# EasyEDA schematic SCH_rover_2025-12-09.json

## Sheets
1 Sheet_1: TITLE: Sheet_1; REV: 1.0; Date: 2025-12-09; Sheet: 1/1; Company: Your Company
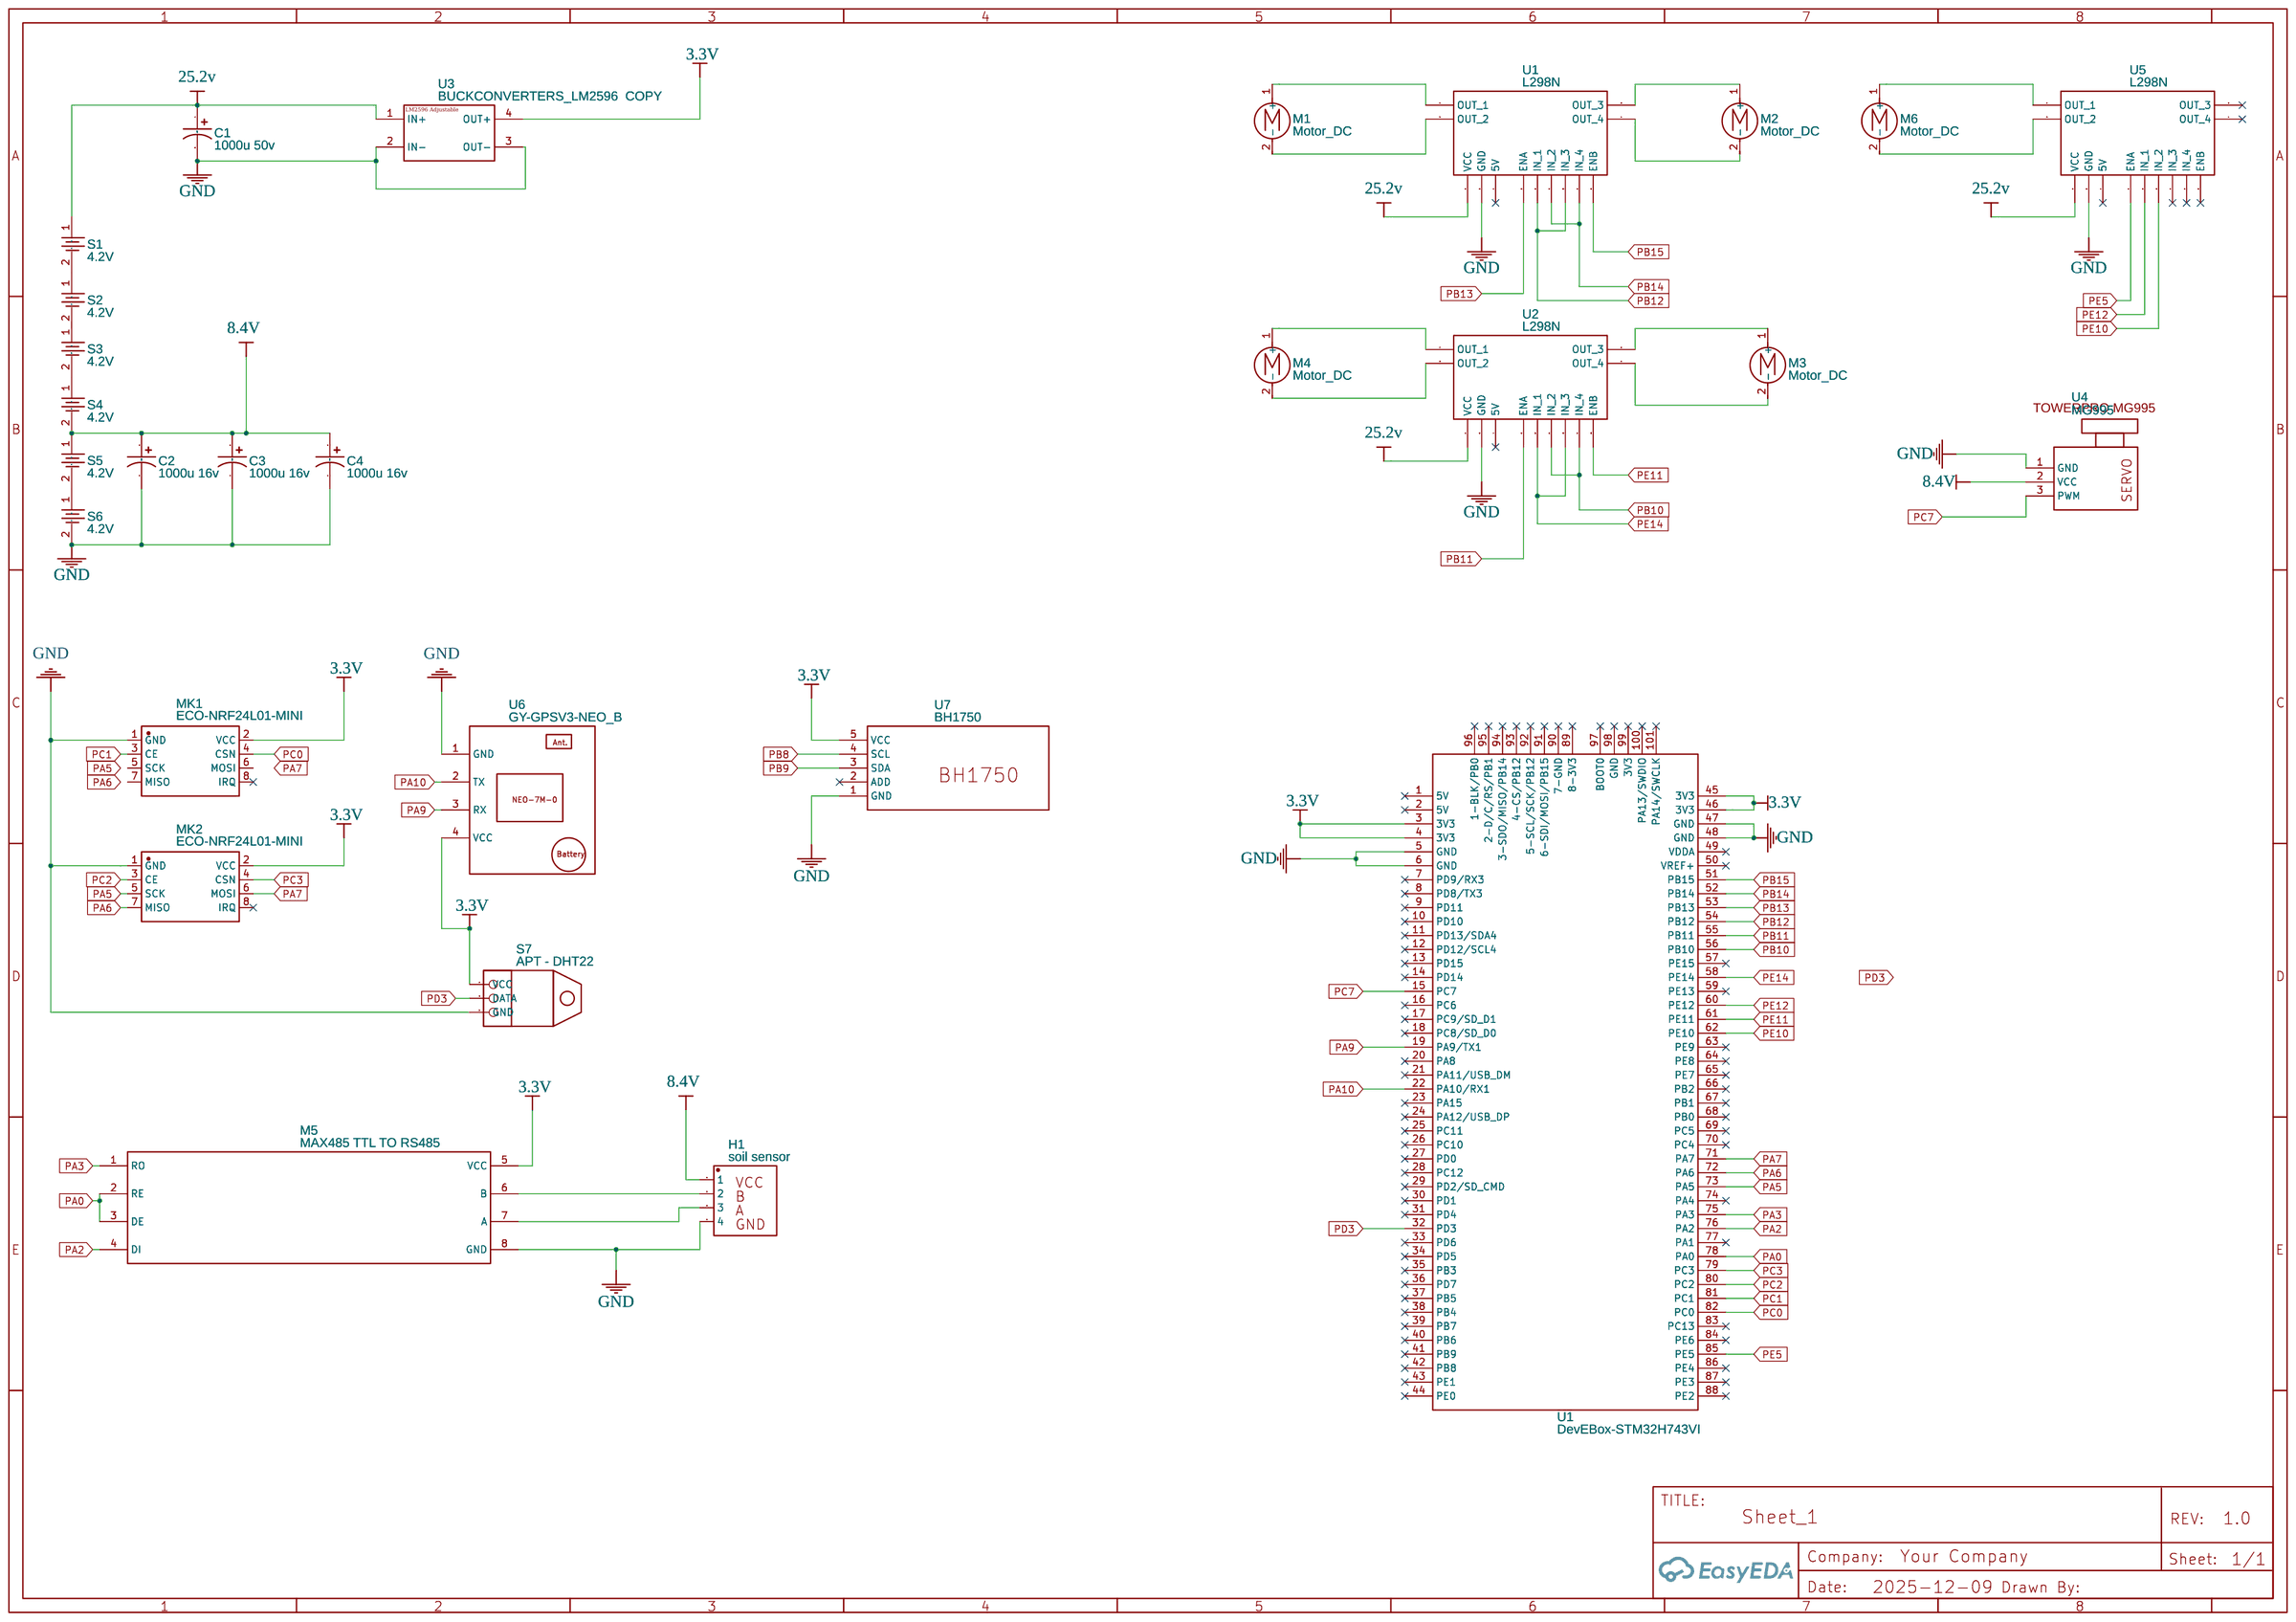
[diagram p0: Sheet_1]
2 Sheet_2: TITLE: Sheet_2
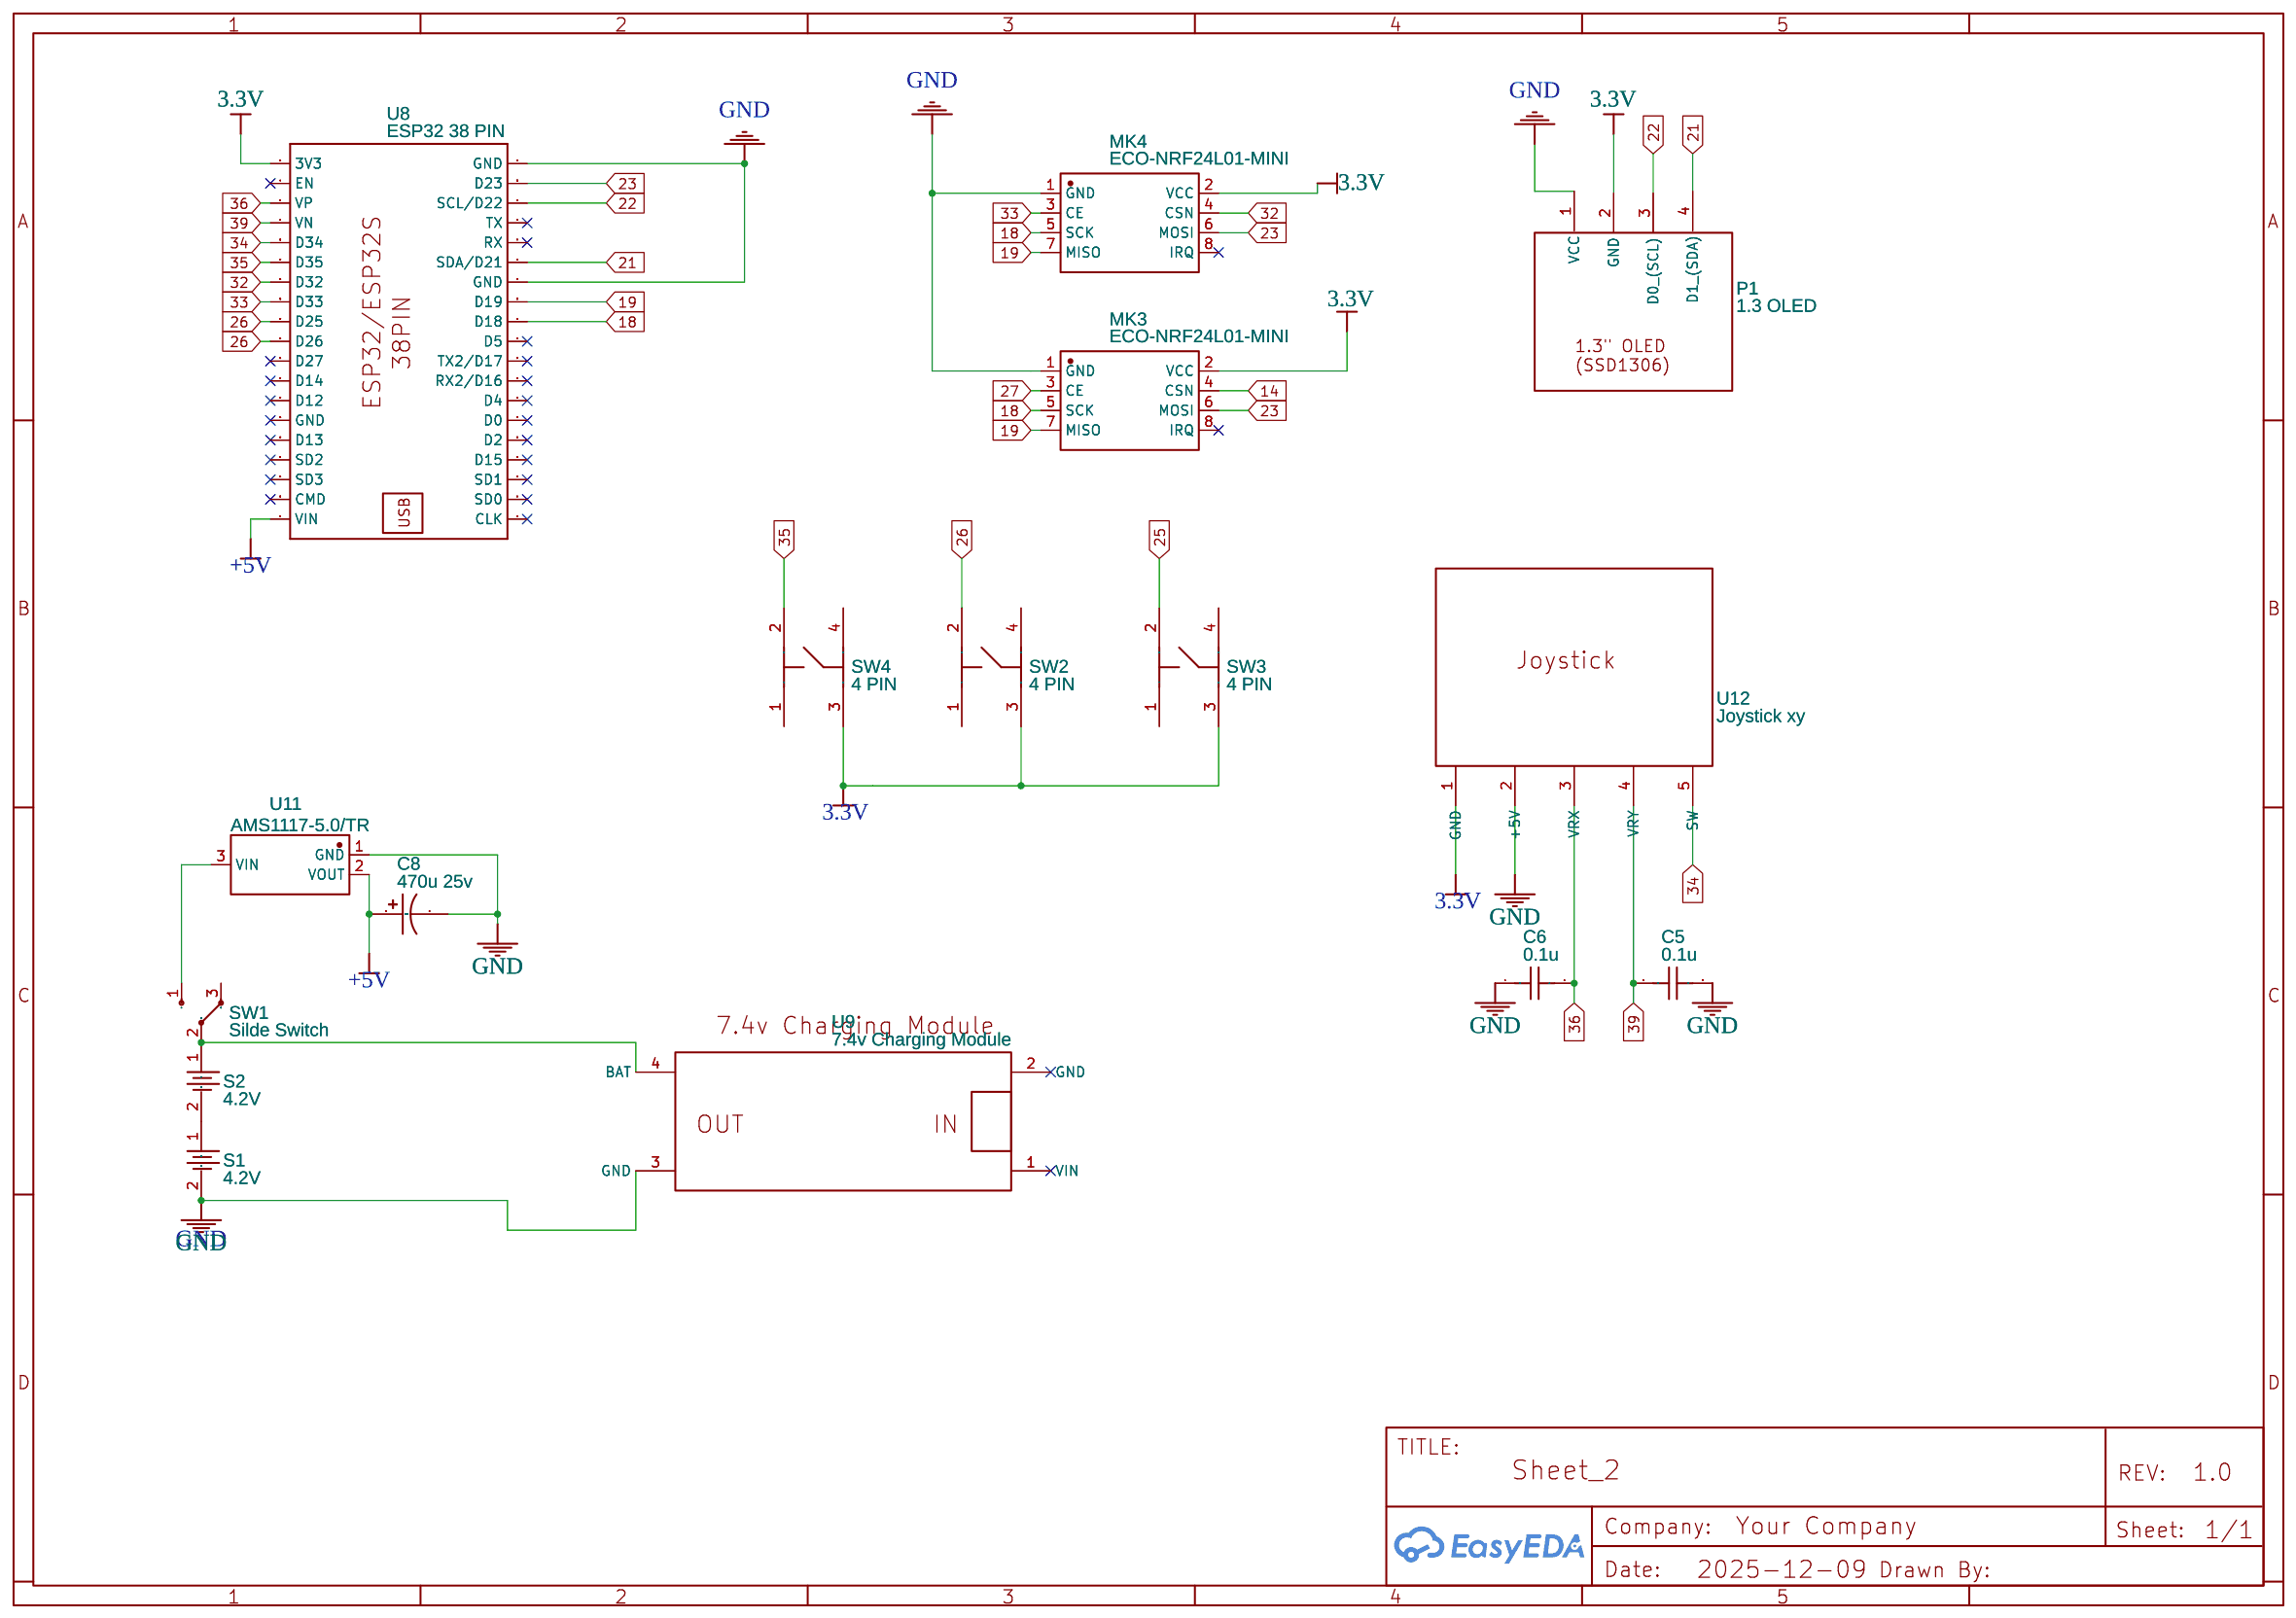
[diagram p1: Sheet_2]

## Parts
sheet Sheet_1
C1  1000u 50v  [CASE-A_3216]
C2  1000u 16v  [CASE-A_3216]
C3  1000u 16v  [CASE-A_3216]
C4  1000u 16v  [CASE-A_3216]
H1  soil sensor  [HEAD-RS485]
M1  Motor_DC  [CONN-TH_2P-P5.08]
M2  Motor_DC  [CONN-TH_2P-P5.08]
M3  Motor_DC  [CONN-TH_2P-P5.08]
M4  Motor_DC  [CONN-TH_2P-P5.08]
M5  MAX485 TTL TO RS485  [MAX485-TTLXRS485]
M6  Motor_DC  [CONN-TH_2P-P5.08]
MK1  ECO-NRF24L01-MINI  [ECO-NRF24L01-MINI]
MK2  ECO-NRF24L01-MINI  [ECO-NRF24L01-MINI]
S1  4.2V  [BAT-SMD_CR1220-2]
S2  4.2V  [BAT-SMD_CR1220-2]
S3  4.2V  [BAT-SMD_CR1220-2]
S4  4.2V  [BAT-SMD_CR1220-2]
S5  4.2V  [BAT-SMD_CR1220-2]
S6  4.2V  [BAT-SMD_CR1220-2]
S7  APT - DHT22  [DHT22]
U1  DevEBox-STM32H743VI  [DEVEBOX_STM32H743]
U1#2  L298N  [L298N]
U2  L298N  [L298N]
U3  BUCKCONVERTERS_LM2596  COPY  [LM2596:YAAJ_DCDC_STEPDOWN_LM2596]
U4  MG995  [NEWSERVOPCB]
U5  L298N  [L298N]
U6  GY-GPSV3-NEO_B  [GY-GPSV3-NEO]
U7  BH1750  [BH1750 (GY-302)]
sheet Sheet_2
C5  0.1u  [C0603]
C6  0.1u  [C0603]
C8  470u 25v  [CASE-A_3216]
MK3  ECO-NRF24L01-MINI  [ECO-NRF24L01-MINI]
MK4  ECO-NRF24L01-MINI  [ECO-NRF24L01-MINI]
P1  1.3 OLED  [SSD1306]
S1#2  4.2V  [BAT-SMD_CR1220-2]
S2#2  4.2V  [BAT-SMD_CR1220-2]
SW1  Silde Switch  [SLIDE SWITCH]
SW2  4 PIN  [4PINPUSHBUTTON]
SW3  4 PIN  [4PINPUSHBUTTON]
SW4  4 PIN  [4PINPUSHBUTTON]
U8  ESP32 38 PIN  [ESP32/ESP32S 38PIN]
U9  7.4v Charging Module  [7.4V CHARGING MODULE]
U11  AMS1117-5.0/TR  [SOT-223-3_L6.5-W3.4-P2.30-LS7.0-BR-1]
U12  Joystick xy  [JOYSICK]

## Library data of the parts
C1-C4 C8 = C_Tan_SMD_A_US: Contributor: LCEDA_Lib
H1 = HEAD-RS485: Supplier: LCSC; Manufacturer: Ckmtw; Manufacturer Part: 210S-1*4P L=11.6MMGold-plated black; Contributor: Sinuhe Pardo; Supplier Part: C124378
M1-M4 M6 = Motor_DC: Contributor: KiCAD; license: https://www.gnu.org/licenses/lgpl-2.1.html
M5 = MAX485 TTL TO RS485: Contributor: hongyam
MK1-MK4 = ECO-NRF24L01-MINI: Supplier: LCSC; Manufacturer: Ai-Thinker; Manufacturer Part: NRF24L01+功率加强版绑定2.4Gwireless module; Supplier Part: C90751; JLCPCB Part Class: Extended Part; Contributor: ecoenghk
S1 S1#2 S2 S2#2 S3-S6 = CR1220-2: Supplier: LCSC; Manufacturer: Q&J; image: //image.lceda.cn/szlcsc/C70381.jpg; Supplier Part: C70381
S7 = APT - DHT22: Contributor: Swade C
U1 = DevEBox-STM32H743VI: Manufacturer: STM; Manufacturer Part: STM32H743VI; link: www.st.com; Contributor: shidieqy
U1#2 U2 U5 = L298N: Contributor: tintertv; sim: true
U3 = BuckConverters_LM2596_Adj: Servo 5V; Add into BOM: yes; Convert to PCB: yes; Origin Footprint: YAAJ_DCDC_StepDown_LM2596; Contributor: wahyusuryantara3581
U4 = MG995: Manufacturer Part: ServoMotor; Contributor: khadija_elsedody
U6 = GY-GPSV3-NEO_B: Contributor: rjshiffer
U7 = BH1750: Manufacturer Part: LoRa - Sensor; Contributor: bjota13
C5 C6 = C_0603_US: Contributor: LCEDA_Lib
P1 = 1.3 OLED: sourceId: yK0HAabLc; Supplier: Brainy Bits; Contributor: Daniel Salajan
SW1 = Silde Switch: Contributor: Dev 91
SW2-SW4 = 4pin push button: Contributor: jason.a.jilla
U8 = ESP32 38 PIN: Contributor: ayhanugur
U9 = 7.4v Charging Module: Contributor: cto.xenon.in
U11 = AMS1117-5.0/TR: Supplier: LCSC; Supplier Part: C41430709; Manufacturer: HGSEMI(华冠); Contributor: lcsc
U12 = Joystick xy: Contributor: 019032350

## Nets
3.3V: M5.5(VCC) MK1.2(VCC) MK2.2(VCC) MK3.2(VCC) MK4.2(VCC) P1.2(GND) S7.1(VCC) SW2.3 SW3.3 SW4.3 U1.3(3V3) U1.4(3V3) U1.45(3V3) U1.46(3V3) U3.4(OUT+) U6.4(VCC) U7.5(VCC) U8.3V3
8.4V: C2.1 C3.1 C4.1 H1.1 S4.2 S5.1 U4.2(VCC)
25.2v: C1.1 S1.1 U1#2.5(VCC) U2.5(VCC) U3.1(IN+) U5.5(VCC)
+5V: C8.1 U8.VIN U11.2(VOUT)
GND: C1.2 C2.2 C3.2 C4.2 C5.2 C6.1 C8.2 H1.4 M5.8(GND) MK1.1(GND) MK2.1(GND) MK3.1(GND) MK4.1(GND) P1.1(VCC) S1#2.2 S6.2 S7.3(GND) U1.5(GND) U1.6(GND) U1.47(GND) U1.48(GND) U1#2.6(GND) U2.6(GND) U3.2(IN-) U3.3(OUT-) U4.1(GND) U5.6(GND) U6.1(GND) U7.1(GND) U8.GND2(GND) U8.GND3(GND) U11.1(GND)
14: MK3.4(CSN)
18: MK3.5(SCK) MK4.5(SCK) U8.D18
19: MK3.7(MISO) MK4.7(MISO) U8.D19
21: P1.4(D1 (SDA)) U8.D21(SDA/D21)
22: P1.3(D0 (SCL)) U8.D22(SCL/D22)
23: MK3.6(MOSI) MK4.6(MOSI) U8.D23
25: SW3.2
26: SW2.2 U8.D25 U8.D26
27: MK3.3(CE)
32: MK4.4(CSN) U8.D32
33: MK4.3(CE) U8.D33
34: U8.D34
35: SW4.2 U8.D35
36: C6.2 U8.VP
39: C5.1 U8.VN
PA0: M5.2(RE) M5.3(DE) U1.78(PA0)
PA2: M5.4(DI) U1.76(PA2)
PA3: M5.1(RO) U1.75(PA3)
PA5: MK2.5(SCK) U1.73(PA5)
PA6: MK2.7(MISO) U1.72(PA6)
PA7: MK2.6(MOSI) U1.71(PA7)
PA9: U1.19(PA9/TX1) U6.3(RX)
PA10: U1.22(PA10/RX1) U6.2(TX)
PB8: U7.4(SCL)
PB9: U7.3(SDA)
PB10: U1.56(PB10) U2.9(IN 2) U2.11(IN 4)
PB11: U1.55(PB11) U2.14(ENA)
PB12: U1.54(PB12) U1#2.8(IN 1) U1#2.10(IN 3)
PB13: U1.53(PB13) U1#2.14(ENA)
PB14: U1.52(PB14) U1#2.9(IN 2) U1#2.11(IN 4)
PB15: U1.51(PB15) U1#2.15(ENB)
PC0: MK1.4(CSN) U1.82(PC0)
PC1: MK1.3(CE) U1.81(PC1)
PC2: MK2.3(CE) U1.80(PC2)
PC3: MK2.4(CSN) U1.79(PC3)
PC7: U1.15(PC7) U4.3(PWM)
PD3: S7.2(DATA) U1.32(PD3)
PE5: U1.85(PE5) U5.14(ENA)
PE10: U1.62(PE10) U5.9(IN 2)
PE11: U1.61(PE11) U2.15(ENB)
PE12: U1.60(PE12) U5.8(IN 1)
PE14: U1.58(PE14) U2.8(IN 1) U2.10(IN 3)
Net-(H1-2): H1.2 M5.6(B)
Net-(H1-3): H1.3 M5.7(A)
Net-(M1-1): M1.1(+) U1#2.1(OUT 1)
Net-(M1-2): M1.2(-) U1#2.2(OUT 2)
Net-(M2-1): M2.1(+) U1#2.3(OUT 3)
Net-(M2-2): M2.2(-) U1#2.4(OUT 4)
Net-(M3-1): M3.1(+) U2.3(OUT 3)
Net-(M3-2): M3.2(-) U2.4(OUT 4)
Net-(M4-1): M4.1(+) U2.1(OUT 1)
Net-(M4-2): M4.2(-) U2.2(OUT 2)
Net-(M6-1): M6.1(+) U5.1(OUT 1)
Net-(M6-2): M6.2(-) U5.2(OUT 2)
Net-(S1#2-1): S1#2.1 S2#2.2
Net-(S1-2): S1.2 S2.1
Net-(S2#2-1): S2#2.1 SW1.2
Net-(S3-2): S3.2 S4.1
Net-(S5-2): S5.2 S6.1
Net-(SW1-1): SW1.1 U11.3(VIN)

Not connected (* = marked no-connect by the designer): MK1 5(SCK) 6(MOSI) 7(MISO) 8(IRQ)*; MK2 8(IRQ)*; MK3 8(IRQ)*; MK4 8(IRQ)*; S2 2; S3 1; SW1 3; SW2 1 4; SW3 1 4; SW4 1 4; U1 1(5V)* 2(5V)* 7(PD9/RX3)* 8(PD8/TX3)* 9(PD11)* 10(PD10)* 11(PD13/SDA4)* 12(PD12/SCL4)* 13(PD15)* 14(PD14)* 16(PC6)* 17(PC9/SD_D1)* 18(PC8/SD_D0)* 20(PA8)* 21(PA11/USB_DM)* 23(PA15)* 24(PA12/USB_DP)* 25(PC11)* 26(PC10)* 27(PD0)* 28(PC12)* 29(PD2/SD_CMD)* 30(PD1)* 31(PD4)* 33(PD6)* 34(PD5)* 35(PB3)* 36(PD7)* 37(PB5)* 38(PB4)* 39(PB7)* 40(PB6)* 41(PB9)* 42(PB8)* 43(PE1)* 44(PE0)* 49(VDDA)* 50(VREF+)* 57(PE15)* 59(PE13)* 63(PE9)* 64(PE8)* 65(PE7)* 66(PB2)* 67(PB1)* 68(PB0)* 69(PC5)* 70(PC4)* 74(PA4)* 77(PA1)* 83(PC13)* 84(PE6)* 86(PE4)* 87(PE3)* 88(PE2)* 89(8-3V3)* 90(7-GND)* 91(6-SDI/MOSI/PB15)* 92(5-SCL/SCK/PB12)* 93(4-CS/PB12)* 94(3-SDO/MISO/PB14)* 95(2-D/C/RS/PB1)* 96(1-BLK/PB0)* 97(BOOT0)* 98(GND)* 99(3V3)* 100(PA13/SWDIO)* 101(PA14/SWCLK)*; U1#2 7(5V)*; U2 7(5V)*; U5 3(OUT 3)* 4(OUT 4)* 7(5V)* 10(IN 3)* 11(IN 4)* 15(ENB)*; U7 2(ADD)*; U8 D0* D2* D4* D5* D6(CLK)* D7(SD0)* D8(SD1)* D9(SD2)* D10(SD3)* D11(CMD)* D12* D13* D14* D15* D16(RX2/D16)* D17(TX2/D17)* D27* EN* GND* RX* TX*; U9 1(VIN) 2(GND) 3(GND) 4(BAT); U12 1(GND) 2(+5V) 3(VRX) 4(VRY) 5(SW)

## Notes on the sheets
sheet 2
- GND
